# Altium schematic sheet SmartSequins9.1.SchDoc
size A4
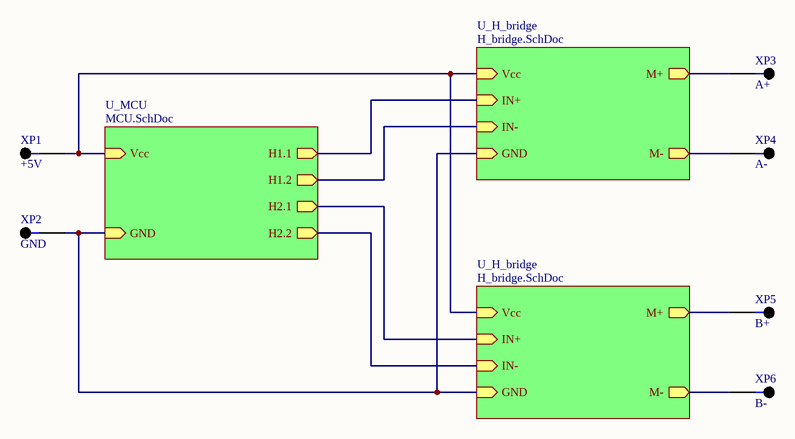
[diagram p0: SmartSequins9.1.SchDoc]

## Parts
XP1  +5V  [XP_solder]
XP2  GND  [XP_solder]
XP3  A+  [XP_solder]
XP4  A-  [XP_solder]
XP5  B+  [XP_solder]
XP6  B-  [XP_solder]

## Sub-sheets
U_H_bridge = H_bridge.SchDoc: IN+ (in), IN- (in), Vcc (in), M+ (out), M- (out), GND (in)
U_H_bridge = H_bridge.SchDoc: IN+ (in), IN- (in), Vcc (in), M+ (out), M- (out), GND (in)
U_MCU = MCU.SchDoc: Vcc (in), GND (in), H1.1 (out), H1.2 (out), H2.1 (out), H2.2 (out)

## Nets
NetXP1_1: XP1.1 ; sheet U_MCU/Vcc, sheet U_H_bridge/Vcc, sheet U_H_bridge/Vcc
NetXP2_1: XP2.1 ; sheet U_MCU/GND, sheet U_H_bridge/GND, sheet U_H_bridge/GND
NetXP3_1: XP3.1 ; sheet U_H_bridge/M+
NetXP4_1: XP4.1 ; sheet U_H_bridge/M-
NetXP5_1: XP5.1 ; sheet U_H_bridge/M+
NetXP6_1: XP6.1 ; sheet U_H_bridge/M-
(unnamed): sheet U_MCU/H1.1, sheet U_H_bridge/IN+
(unnamed): sheet U_MCU/H1.2, sheet U_H_bridge/IN-
(unnamed): sheet U_MCU/H2.1, sheet U_H_bridge/IN+
(unnamed): sheet U_MCU/H2.2, sheet U_H_bridge/IN-

## Library data of the parts
XP1-XP6 = XP_solder